# EAGLE design gtop (EAGLE 6.1)
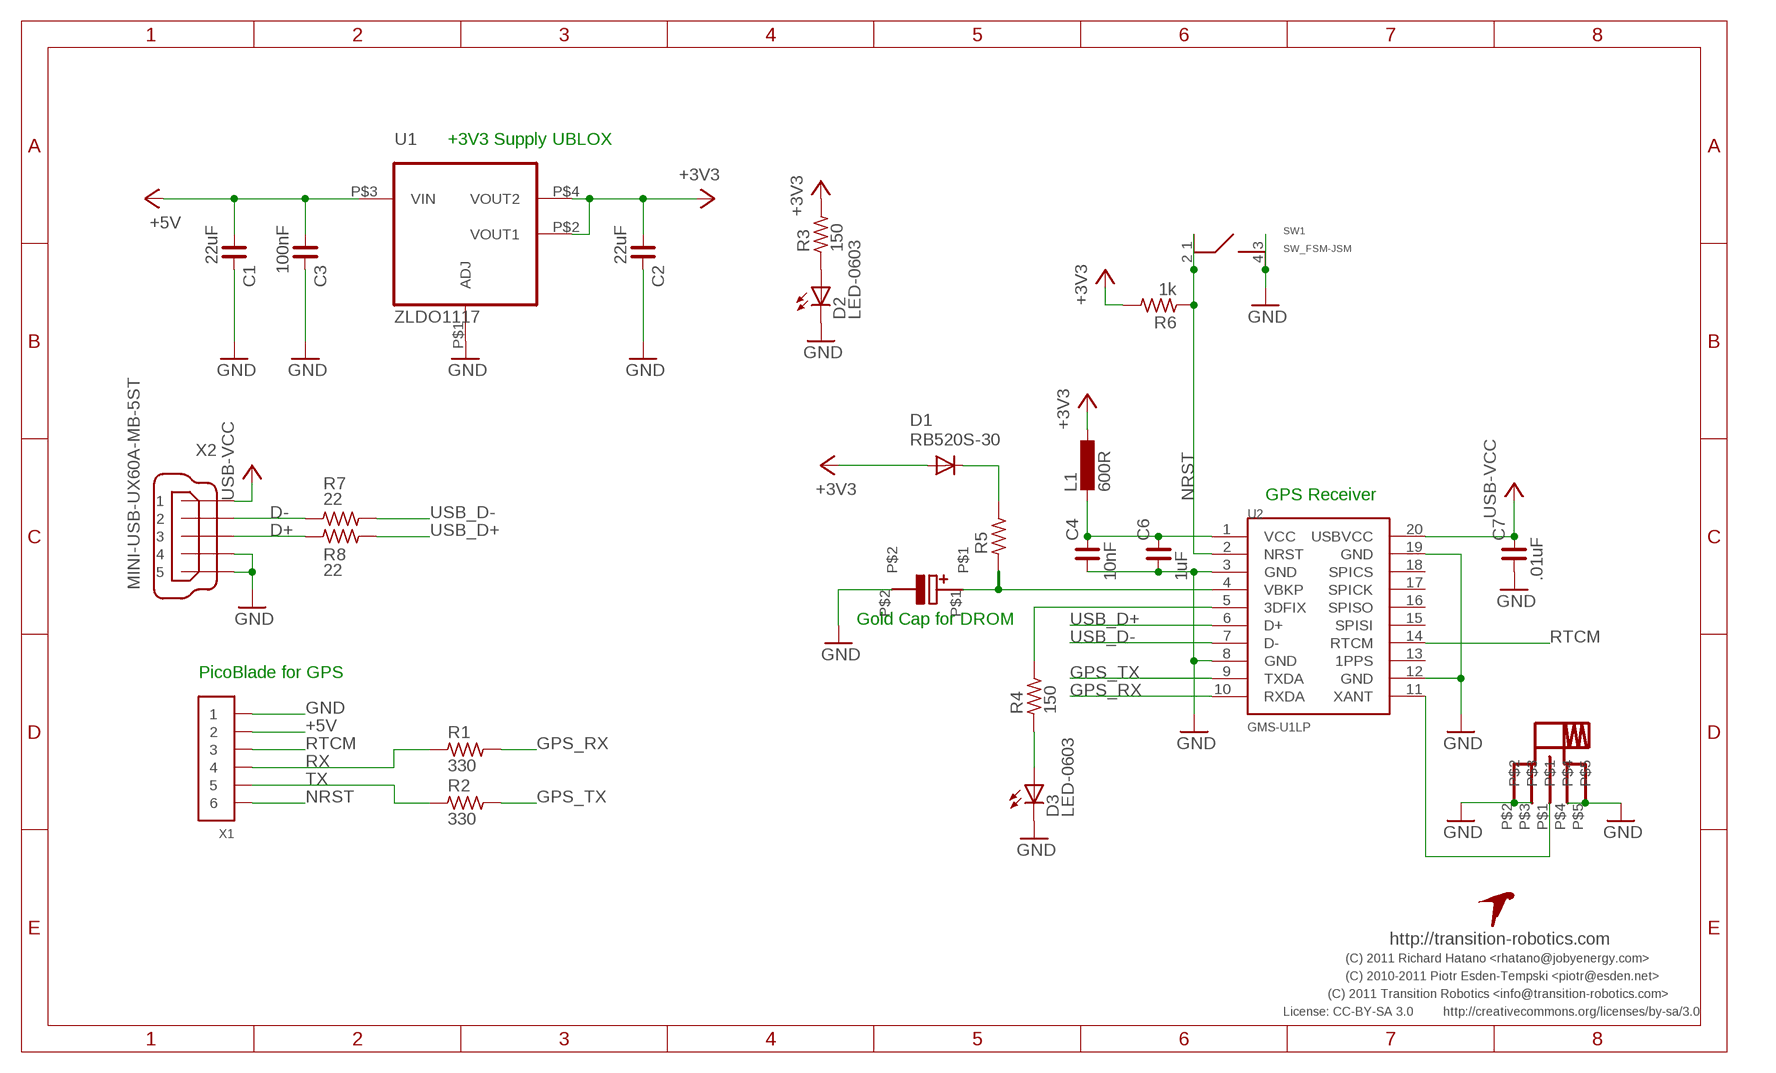
[diagram p0: schematic, sheet 1]

## Parts
C1  22uF  C_0805  [C0805]
C2  22uF  C_0805  [C0805]
C3  100nF  C_0805  [C0805]
C4  10nF  C_0603  [C0603]
C5  EECEN0F204AK  [EECEN0F204AK]
C6  1uF  C_0603  [C0603]
C7  .01uF  C_0603  [C0603]
D1  RB520S-30  DIODE  [SOD523-DIO]
D2  LED-0603  [0603-LED]
D3  LED-0603  [0603-LED]
J1  JOBY_ROBOTICS_SMA  [JOBY_ROBOTICS_SMA]
L1  600R  INDUCTOR-0603  [0603-IND]
R1  330  R_0603  [R0603]
R2  330  R_0603  [R0603]
R3  150  R_0603  [R0603]
R4  150  R_0603  [R0603]
R5  R_0603  [R0603]
R6  1k  R_0603  [R0603]
R7  22  R_0603  [R0603]
R8  22  R_0603  [R0603]
SW1  SW_FSM-JSM  [SW-FSM_JSM]
U1  ZLDO1117  [ZLDO1117]
U2  GMS-U1LP  [GMS-U1LP]
U$3  TR-LOGO  [TR-LOGO]
X1  CONN_6-1-53261  [PB-53261-06]
X2  MINI-USB-UX60A-MB-5ST  [UX60A-MB-5ST]

## Nets
+3V3: C2.1 D1.2(A) L1.P$1 R3.2 R6.2 U1.P$2(VOUT1) U1.P$4(VOUT2)
+5V: C1.1 C3.1 U1.P$3(VIN) X1.2
D+: R8.1 X2.3
D-: R7.1 X2.2
GND: C1.2 C2.2 C3.2 C4.1 C5.P$2 C6.1 C7.1 D2.C D3.C J1.P$2 J1.P$3 J1.P$4 J1.P$5 SW1.3 SW1.4 U1.P$1(ADJ) U2.3(GND) U2.8(GND) U2.12(GND) U2.19(GND) X1.1 X2.4 X2.5
GPS_RX: R1.2 U2.10(RXDA)
GPS_TX: R2.2 U2.9(TXDA)
N$1: J1.P$1 U2.11(XANT)
N$2: R4.2 U2.5(3DFIX)
N$3: D1.1(C) R5.2
N$4: C5.P$1 R5.1 U2.4(VBKP)
N$5: C4.2 C6.2 L1.P$2 U2.1(VCC)
N$6: D3.A R4.1
N$7: D2.A R3.1
NRST: R6.1 SW1.1 SW1.2 U2.2(NRST) X1.6
RTCM: U2.14(RTCM) X1.3
RX: R1.1 X1.4
TX: R2.1 X1.5
USB-VCC: C7.2 U2.20(USBVCC) X2.1
USB_D+: R8.2 U2.6(D+)
USB_D-: R7.2 U2.7(D-)
Unconnected: U2.13(1PPS) U2.15(SPISI) U2.16(SPISO) U2.17(SPICK) U2.18(SPICS)

## Notes on the sheet
- +3V3 Supply UBLOX
- GPS Receiver
- Gold Cap for DROM
- PicoBlade for GPS
- http://transition-robotics.com
- (C) 2011 Richard Hatano <rhatano@jobyenergy.com>
- (C) 2010-2011 Piotr Esden-Tempski <piotr@esden.net>
- (C) 2011 Transition Robotics <info@transition-robotics.com>
- License: CC-BY-SA 3.0 | http://creativecommons.org/licenses/by-sa/3.0

## Library data of the parts
C1-C4 C6 C7 = rc-master-smd:C_: NON-POLARIZED CAP
C5 = gold_cap:EECEN0F204AK
D1 = pel_dipol_comp:DIODE
D2 D3 = pel_dipol_comp:LED
J1 = joby_robotics:JOBY_ROBOTICS_SMA
L1 = pel_dipol_comp:INDUCTOR
R1-R8 = rc-master-smd:R_: RESISTOR
SW1 = joby_robotics:SW_FSM-JSM
U1 = joby_robotics:ZLDO1117
U2 = joby_robotics:GMS-U1LP
U$3 = quadshot:TR-LOGO; BOM: EXCLUDE; PARTNO: *
X1 = pel_molex:CONN_6-1
X2 = con-hirose:MINI-USB-: MINI USB Connector Source: http://www.hirose.co.jp/cataloge_hp/e24000019.pdf

## Board
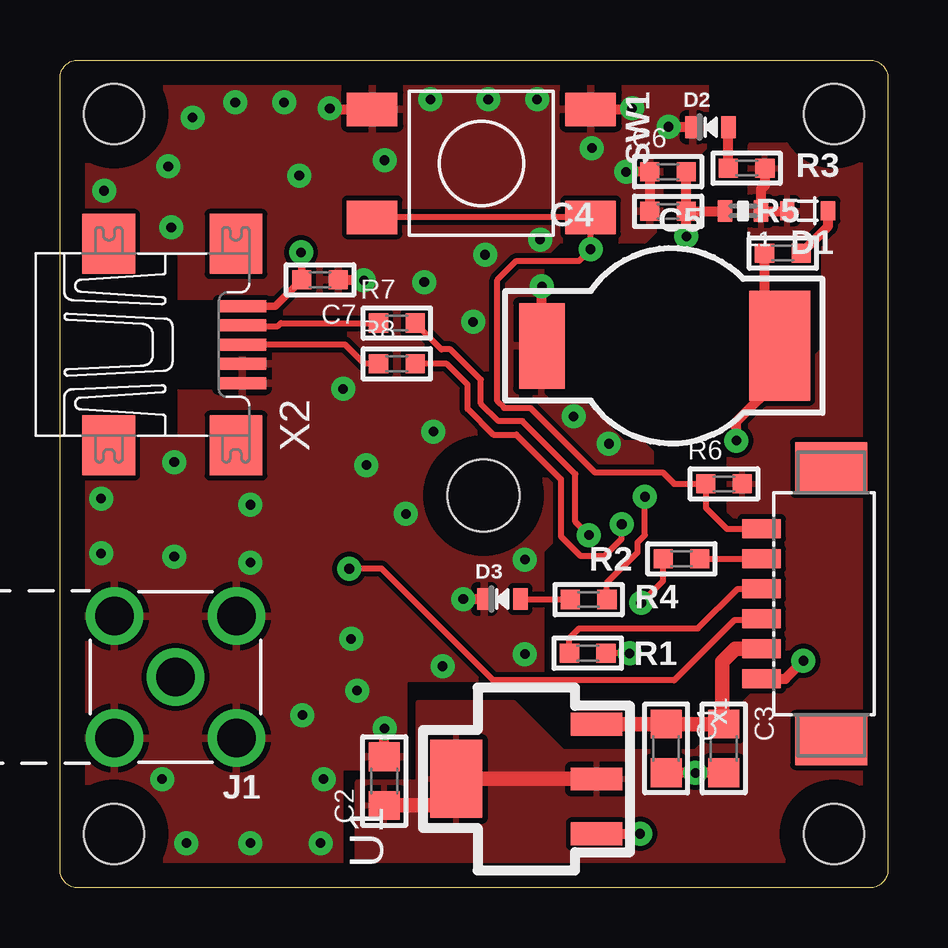
[diagram p1: board, top side]
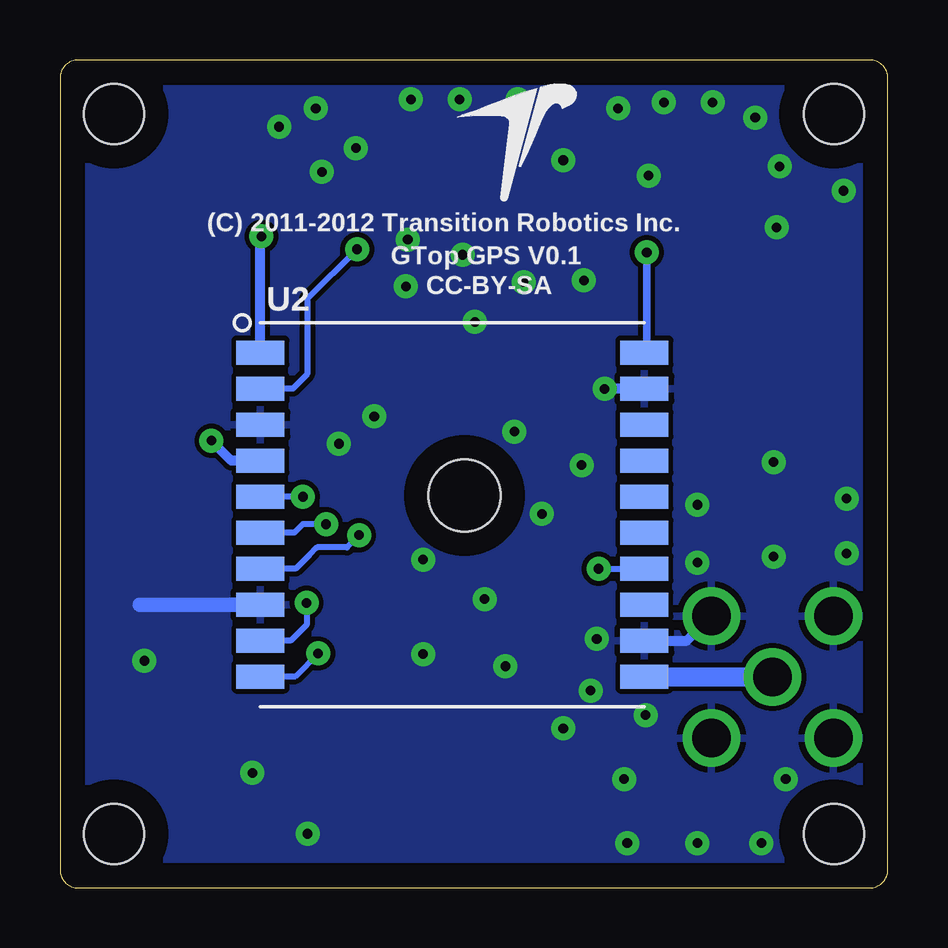
[diagram p2: board, bottom side, seen from below]

Size 34.49 x 34.49 mm. Coordinates in mm from the lower left corner, seen from the top.
Outline: 0.75,34.49 33.74,34.49 arc-90 34.49,33.74 34.49,0.75 arc-90 33.74,0 0.75,0 arc-90 0,0.75 0,33.74 arc-90 0.75,34.49
Copper layers (1*16): Top 0.035mm / dielectric 0.15mm / Bottom 0.035mm
Design rules: minimum track width 8mil, minimum drill 0.4mm, track to track 8mil, track to pad 8mil, pad to pad 8mil, via to via 8mil, smd to smd 8mil, copper to edge 40mil, drill to drill 8mil, minimum pad ring 10mil, minimum via ring 0.3mm, stop-mask expansion 4mil, vias tented up to drill 0.4mm, thermal gap 10mil
Holes 2.5 mm at 2.25,32.25 32.25,32.25 32.25,2.25 2.25,2.25

### Footprints (pad centres in the part's own frame; a part is rotated, then mirrored left to right if it is on the bottom)
C0805 = smd 1.2 x 1.3: 1 -1.016,0; 2 1.016,0
C0603 = smd 0.8 x 0.8: 1 -0.762,0; 2 0.762,0
EECEN0F204AK = smd 4.572 x 2.54: P$1 0,4.572 | smd 3.556 x 1.905: P$2 0,-5.334
SOD523-DIO = smd 0.6 x 0.8: 1 -0.85,0; 2 0.85,0
0603-LED = smd 0.6 x 0.9: A 0.75,0; C -0.75,0
JOBY_ROBOTICS_SMA = drill 1.6: P$1 0,0; P$2 2.54,2.54; P$3 2.54,-2.54; P$4 -2.54,-2.54; P$5 -2.54,2.54
0603-IND = smd 0.6 x 0.9: P$1 -0.75,0; P$2 0.75,0
R0603 = smd 0.8 x 0.8: 1 -0.762,0; 2 0.762,0
SW-FSM_JSM = smd 1.4 x 2.1: 1 2.25,4.55; 2 2.25,-4.55; 3 -2.25,4.55; 4 -2.25,-4.55
ZLDO1117 = smd 0.952 x 2.146: P$1 -2.286,-2.921; P$2 0,-2.921; P$3 2.286,-2.921 | smd 3.251 x 2.159: P$4 0,2.921
GMS-U1LP = smd 2 x 1: 1 -8,6.75; 2 -8,5.25; 3 -8,3.75; 4 -8,2.25; 5 -8,0.75; 6 -8,-0.75; 7 -8,-2.25; 8 -8,-3.75; 9 -8,-5.25; 10 -8,-6.75; 11 8,-6.75; 12 8,-5.25; 13 8,-3.75; 14 8,-2.25; 15 8,-0.75; 16 8,0.75; 17 8,2.25; 18 8,3.75; 19 8,5.25; 20 8,6.75 | hole 3: 0.5,0.8
PB-53261-06 = smd 0.8 x 1.6: 1 -3.125,1.1; 2 -1.875,1.1; 3 -0.625,1.1; 4 0.625,1.1; 5 1.875,1.1; 6 3.125,1.1 | smd 2.1 x 3: MNT1 -5.675,-1.8; MNT2 5.675,-1.8
UX60A-MB-5ST = smd 2 x 0.5: 1 2.25,1.6; 2 2.25,0.8; 3 2.25,0; 4 2.25,-0.8; 5 2.25,-1.6 | smd 2.2 x 2.5: M1 -3.3,-4.2; M2 -3.3,4.2; M3 2,4.2; M4 2,-4.2

### Placement (x,y rotation side)
C1  25.26,5.81 270 top
C2  13.51,4.45 90 top
C3  27.66,5.81 270 top
C4  25.34,28.19 0 top
C5  25.42,22.58 270 top
C6  25.34,29.84 0 top
C7  10.83,25.33 180 top
D1  31.15,28.21 180 top
D2  27.11,31.69 0 top
D3  18.43,12.03 0 top
J1  4.81,8.78 180 top
L1  28.46,28.2 180 top
R1  21.99,9.78 0 top
R2  25.89,13.71 180 top
R3  28.61,29.99 0 top
R4  22.03,12.01 0 top
R5  30.12,26.45 0 top
R6  27.67,16.83 0 top
R7  14.03,23.53 0 top
R8  14.03,21.83 0 top
SW1  17.56,30.18 270 top
U1  19.43,4.54 90 top
U2  18.14,15.55 0 bottom
U$3  15.46,31.05 0 bottom
X1  30.33,11.83 90 top
X2  5.33,22.63 0 top

### Tracks (layer width: path | path; a pad name or v marks a point on that pad's centre or on a via)
+3V3
  Top 0.406: L1.P$1 29.21,29.11 29.37,29.27 R3.2 | L1.P$1 | L1.P$1 30.29,28.2 D1.2
  Top 0.61: U1.P$2 U1.P$4 16.52,3.44 15.05,3.44 14.55,3.44 C2.1
  pour Top: 12.41,-0.04 12.41,4.41 14.95,4.41 14.95,7.71 18.88,7.71 20.92,5.68 26.5,5.68 30.31,9.49 30.31,13.3 27.9,15.71 27.9,18.5 31.84,22.44 31.84,26.63 31.2,27.27 28.79,27.27 28.79,30.95 34.51,30.95 34.51,-0.04
+5V
  Top 0.61: X1.2 28.14,9.96 27.6,9.41 27.6,6.88 C3.1 C1.1 U1.P$3
D+
  Top 0.254: X2.3 11.88,22.63 12.69,21.83 R8.1
D-
  Top 0.254: R7.1 9.21,23.53 9.08,23.41 7.61,23.41 X2.2
GND  (via drill 0.4)
  Top 0.406: C3.2 v26.48,4.79 v26.47,4.79 C1.2 25.16,4.79 | U1.P$1 v24.17,2.25 v24.17,2.26 | X1.1 30.22,8.71 v30.97,9.46 | C2.2 13.52,6.55 v13.53,6.64 | SW1.4 11.28,32.43 v11.24,32.47 | SW1.3 23.8,32.43 v23.84,32.47 | D3.C v16.81,12.03 v16.8,12.03 | D2.C 25.38,31.69 v25.36,31.71 | C4.1 C6.1 v23.59,29.84 v23.58,29.83 | C7.1 12.64,25.33 v12.66,25.31 | C5.P$2 20.08,24.85 v20.08,25.06
  Bottom 0.406: U2.12 8.37,10.3 J1.P$4 | U2.19 v11.79,20.8 v11.8,20.79
  Bottom 0.61: U2.8 31.18,11.8
  other vias: 22.87,18.5 9.33,32.73 7.3,32.73 5.52,32.09 4.51,30.06 1.84,29.04 4.64,27.52 17.21,23.58 20,27.01 17.72,26.38 15.18,25.23 22.16,30.82 19.88,32.85 17.84,32.85 15.43,32.85 1.71,16.22 1.71,13.93 4.25,4.53 5.27,1.87 7.94,1.87 10.86,1.87 10.99,4.53 15.94,9.23 19.37,9.74 19.37,13.68 14.41,15.58 15.56,19.01 12.76,17.61 7.94,15.96 7.94,13.55 4.76,17.74 4.76,13.8 13.53,30.31 9.97,29.68 12.13,10.38 21.4,19.65 12.38,8.22 10.1,7.2
  pour Bottom: -0.04,-0.04 34.51,-0.04 34.51,34.51 -0.04,34.51
  pour Top (rank 2): 0.09,-0.04 11.65,-0.04 11.65,5.04 14.31,5.04 14.31,8.72 20.03,8.72 20.03,10.38 20.03,14.06 22.57,16.6 23.71,16.6 24.6,17.49 24.6,18.12 24.22,18.5 23.46,18.5 21.93,20.03 20.54,20.03 20.03,20.54 20.03,26.25 20.79,27.01 24.35,27.01 24.98,27.65 24.98,30.31 25.36,30.7 26.63,30.7 26.89,30.95 26.89,34.51 -0.04,34.51 -0.04,-0.04
GPS_RX  (via drill 0.4)
  Top 0.254: v23.74,9.77 23.73,9.78 R1.2
  Bottom 0.254: U2.10 26.12,8.83 24.68,8.83 v23.74,9.77
GPS_TX  (via drill 0.4)
  Top 0.254: R2.2 25.13,12.79 v24.22,11.87
  Bottom 0.254: v24.22,11.87 24.22,10.96 24.88,10.3 U2.9
N$1
  Bottom 0.787: U2.11 4.83,8.8 J1.P$1
N$2  (via drill 0.4)
  Top 0.254: R4.2 22.79,12.7 24.07,13.98 24.07,14.39 24.37,14.69 v24.37,16.29
  Bottom 0.254: v24.37,16.29 U2.5
N$3
  Top 0.406: D1.1 32,27.57 R5.2
N$4  (via drill 0.4)
  Top 0.406: v28.18,18.63 28.18,19.42 29.98,21.22 29.98,22.53 C5.P$1 29.36,23.16 R5.1
  Bottom 0.406: U2.4 27.35,17.8 v28.18,18.63
N$5  (via drill 0.4)
  Top 0.406: v26.1,27.14 C4.2 | C4.2 C6.2 | C4.2 27.7,28.19 L1.P$2
  Bottom 0.406: U2.1 26.14,27.07 v26.1,27.14
N$6
  Top 0.254: R4.1 19.21,12.01 D3.A
N$7
  Top 0.406: R3.1 27.85,31.68 D2.A
NRST  (via drill 0.4)
  Top 0.254: SW1.2 SW1.1 22.11,27.65 v22.11,26.61 21.63,26.12 19.01,26.12 18.22,25.34 18.22,20.28 18.5,20 19.6,20 22.29,17.31 25.11,17.31 25.59,16.83 R6.1 26.91,15.84 27.79,14.96 X1.6
  Bottom 0.254: U2.2 24.79,20.8 24.19,21.4 24.19,24.55 v22.11,26.61
RTCM  (via drill 0.4)
  Top 0.254: X1.3 29.19,11.16 28.1,11.16 25.59,8.65 18.05,8.65 13.4,13.3 v12.05,13.3
  Bottom 0.254: v12.05,13.3 U2.14
RX
  Top 0.254: R1.1 21.22,10.4 21.63,10.81 26.58,10.81 28.23,12.46 X1.4 | X1.4
TX
  Top 0.254: R2.1 X1.5
USB-VCC  (via drill 0.4)
  Top 0.305: X2.1 8.97,24.23 C7.2 10.07,26.45 v10.05,26.48
  Bottom 0.305: v10.05,26.48 10.05,22.4 U2.20
USB_D+  (via drill 0.4)
  Top 0.254: v23.41,15.15 23.41,14.54 22.69,13.83 21.68,13.83 20.87,14.64 20.87,17.03 19.01,18.88 18.05,18.88 16.98,19.95 16.98,20.97 16.12,21.83 15.4,21.83 R8.2
  Bottom 0.254: U2.6 24.72,14.8 24.37,15.15 v23.41,15.15
USB_D-  (via drill 0.4)
  Top 0.254: v22.03,14.69 21.48,15.25 21.48,17.23 19.27,19.44 18.27,19.44 17.54,20.18 17.54,21.17 16.27,22.44 15.89,22.44 R7.2
  Bottom 0.254: v22.03,14.69 22.54,14.19 23.79,14.19 24.12,13.85 24.67,13.3 U2.7

### Text on the board
bPlace: (C) 2011-2012 Transition Robotics Inc. | GTop GPS V0.1 | CC-BY-SA
Reference: Licensed under: | (C) 2010-2012 Piotr Esden-Tempski <piotr@esden.net> | CC-BY-SA 3.0 | (C) 2011 Richard Hatano <rhatano@jobyenergy.com> | (C) 2011-2012 Transition Robotics <info@transition-robotics.com> | http://creativecommons.org/licenses/by-sa/3.0/